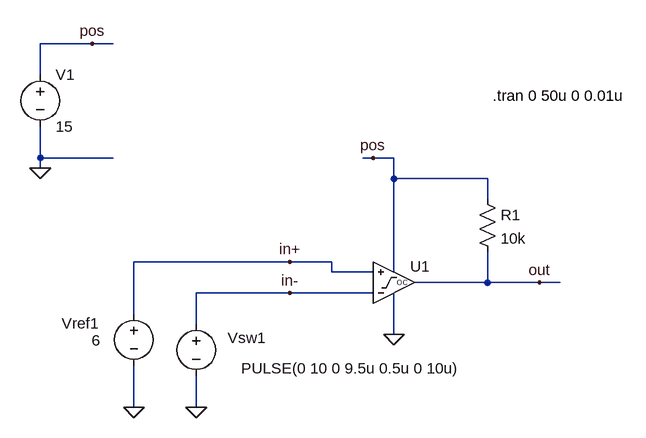
[diagram p0: schematic MyComparatorOC Test.asc]
MyComparatorOC Test.asc, the LTspice schematic file:
Version 4
SHEET 1 976 680
WIRE -48 -320 -128 -320
WIRE -16 -320 -48 -320
WIRE -128 -272 -128 -320
WIRE -128 -144 -128 -192
WIRE -16 -144 -128 -144
WIRE 384 -144 368 -144
WIRE 416 -144 384 -144
WIRE -128 -128 -128 -144
WIRE 416 -112 416 -144
WIRE 560 -112 416 -112
WIRE 560 -80 560 -112
WIRE 256 16 16 16
WIRE 320 16 256 16
WIRE 320 32 320 16
WIRE 384 32 320 32
WIRE 416 32 416 -112
WIRE 560 48 560 0
WIRE 560 48 448 48
WIRE 640 48 560 48
WIRE 672 48 640 48
WIRE 256 64 112 64
WIRE 384 64 256 64
WIRE 16 96 16 16
WIRE 112 112 112 64
WIRE 416 128 416 64
WIRE 16 240 16 176
WIRE 112 240 112 192
FLAG 16 240 0
FLAG 112 240 0
FLAG 256 16 in+
FLAG 256 64 in-
FLAG -128 -128 0
FLAG -48 -320 pos
FLAG 384 -144 pos
FLAG 640 48 out
FLAG 416 128 0
SYMBOL voltage 112 96 M0
WINDOW 123 0 0 Left 0
WINDOW 39 0 0 Left 0
WINDOW 3 -407 84 Left 2
WINDOW 0 -107 37 Left 2
SYMATTR Value PULSE(0 10 0 9.5u 0.5u 0 10u)
SYMATTR InstName Vsw1
SYMBOL voltage 16 80 M0
WINDOW 123 0 0 Left 0
WINDOW 39 0 0 Left 0
WINDOW 0 53 31 Left 2
WINDOW 3 51 57 Left 2
SYMATTR InstName Vref1
SYMATTR Value 6
SYMBOL voltage -128 -288 R0
WINDOW 123 0 0 Left 0
WINDOW 39 0 0 Left 0
SYMATTR InstName V1
SYMATTR Value 15
SYMBOL res 544 -96 R0
SYMATTR InstName R1
SYMATTR Value 10k
SYMBOL MyComparatorOC 416 48 R0
SYMATTR InstName U1
TEXT 568 -240 Left 2 !.tran 0 50u 0 0.01u

The netlist it stands for:
* MyComparatorOC Test.asc
Vsw1 in- 0 PULSE(0 10 0 9.5u 0.5u 0 10u)
Vref1 in+ 0 6
V1 pos 0 15
R1 pos out 10k
XU1 in+ in- pos out 0 MyComparatorOC  ; pins in+ in- pos col emit
.tran 0 50u 0 0.01u
.lib MyComparatorOC.sub
.backanno
.end